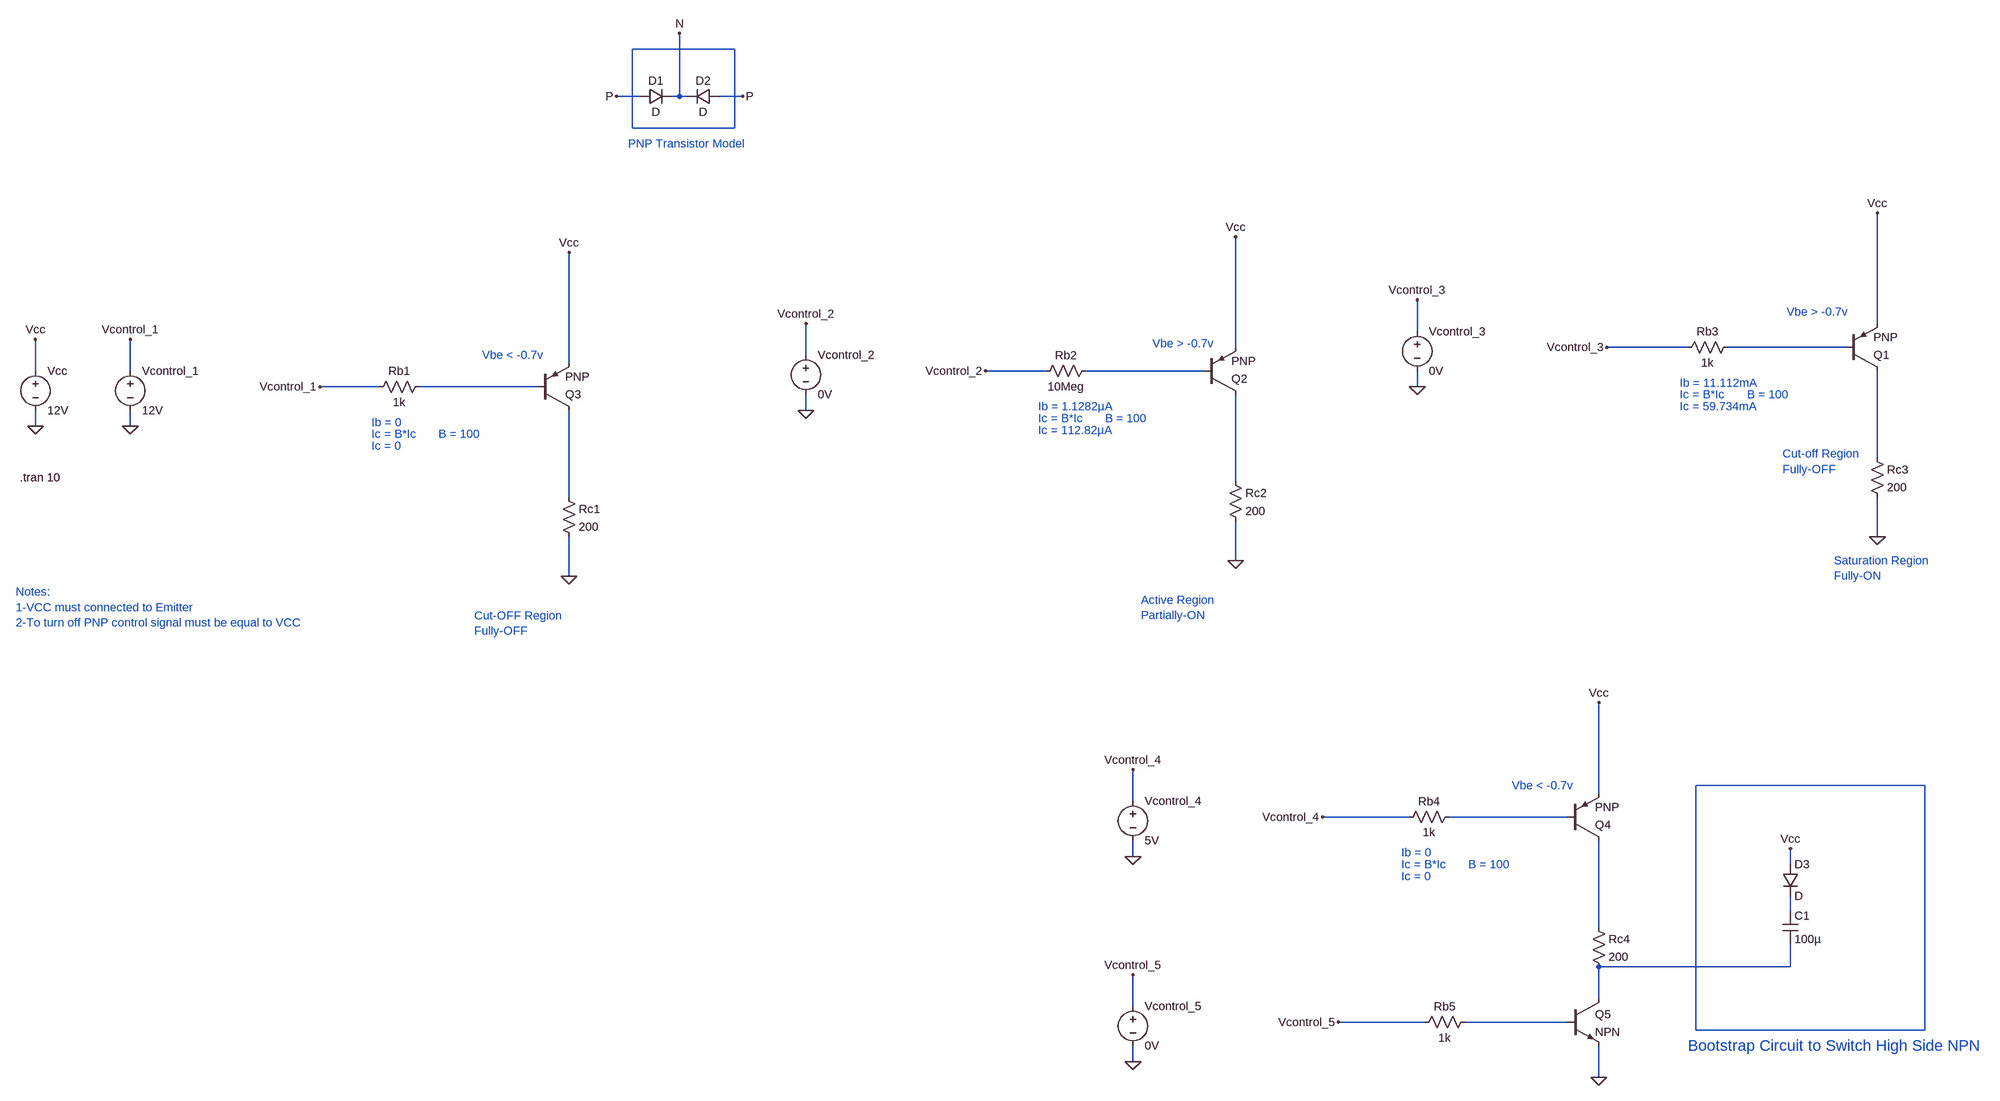
[diagram p0: schematic PNP Transistor.asc]
PNP Transistor.asc, the LTspice schematic file:
Version 4.1
SHEET 1 3440 2628
WIRE 768 -672 560 -672
WIRE 576 -576 528 -576
WIRE 656 -576 656 -704
WIRE 656 -576 640 -576
WIRE 672 -576 656 -576
WIRE 784 -576 736 -576
WIRE 560 -512 560 -672
WIRE 768 -512 768 -672
WIRE 768 -512 560 -512
WIRE 3168 48 3168 -176
WIRE 2224 64 2224 0
WIRE 1856 96 1856 -128
WIRE 2784 96 2608 96
WIRE 3104 96 2864 96
WIRE 912 112 912 48
WIRE 432 128 432 -96
WIRE -704 144 -704 80
WIRE -512 144 -512 80
WIRE 1472 144 1296 144
WIRE 1792 144 1552 144
WIRE 48 176 -128 176
WIRE 368 176 128 176
WIRE 2224 176 2224 144
WIRE 912 224 912 192
WIRE -704 256 -704 224
WIRE -512 256 -512 224
WIRE 3168 320 3168 144
WIRE 1856 368 1856 192
WIRE 432 400 432 224
WIRE 3168 480 3168 400
WIRE 1856 528 1856 448
WIRE 432 560 432 480
WIRE 3264 1904 2800 1904
WIRE 2592 1920 2592 1696
WIRE 1648 1936 1648 1872
WIRE 2208 1968 2032 1968
WIRE 2528 1968 2288 1968
WIRE 1648 2048 1648 2016
WIRE 2992 2064 2992 2032
WIRE 2992 2160 2992 2128
WIRE 2592 2192 2592 2016
WIRE 2992 2272 2992 2224
WIRE 2992 2272 2592 2272
WIRE 2592 2336 2592 2272
WIRE 1648 2352 1648 2288
WIRE 2240 2384 2064 2384
WIRE 2528 2384 2320 2384
WIRE 2800 2400 2800 1904
WIRE 3264 2400 3264 1904
WIRE 3264 2400 2800 2400
WIRE 1648 2464 1648 2432
WIRE 2592 2496 2592 2432
FLAG 3168 480 0
FLAG 2608 96 Vcontrol_3
FLAG 3168 -176 Vcc
FLAG -704 256 0
FLAG -704 80 Vcc
FLAG 2224 176 0
FLAG 2224 0 Vcontrol_3
FLAG 528 -576 P
FLAG 784 -576 P
FLAG 656 -704 N
FLAG 1856 528 0
FLAG 1296 144 Vcontrol_2
FLAG 1856 -128 Vcc
FLAG 912 224 0
FLAG 912 48 Vcontrol_2
FLAG 432 560 0
FLAG -128 176 Vcontrol_1
FLAG 432 -96 Vcc
FLAG -512 256 0
FLAG -512 80 Vcontrol_1
FLAG 2032 1968 Vcontrol_4
FLAG 2592 1696 Vcc
FLAG 1648 2048 0
FLAG 1648 1872 Vcontrol_4
FLAG 2592 2496 0
FLAG 2064 2384 Vcontrol_5
FLAG 2992 2032 Vcc
FLAG 1648 2464 0
FLAG 1648 2288 Vcontrol_5
DATAFLAG 2704 96 ""
DATAFLAG 3168 -80 ""
DATAFLAG 3168 224 ""
DATAFLAG 2960 96 ""
DATAFLAG 1392 144 ""
DATAFLAG 1856 -32 ""
DATAFLAG 1856 272 ""
DATAFLAG 1648 144 ""
DATAFLAG -32 176 ""
DATAFLAG 432 0 ""
DATAFLAG 432 304 ""
DATAFLAG 224 176 ""
DATAFLAG 2128 1968 ""
DATAFLAG 2592 1792 ""
DATAFLAG 2592 2096 ""
DATAFLAG 2384 1968 ""
DATAFLAG 2160 2384 ""
DATAFLAG 2416 2384 ""
SYMBOL res 2880 80 R90
WINDOW 0 0 56 VBottom 2
WINDOW 3 32 56 VTop 2
SYMATTR InstName Rb3
SYMATTR Value 1k
SYMBOL voltage -704 128 R0
SYMATTR InstName Vcc
SYMATTR Value 12V
SYMBOL voltage 2224 48 R0
WINDOW 123 0 0 Left 0
WINDOW 39 0 0 Left 0
SYMATTR InstName Vcontrol_3
SYMATTR Value 0V
SYMBOL diode 576 -560 R270
WINDOW 0 32 32 VTop 2
WINDOW 3 0 32 VBottom 2
SYMATTR InstName D1
SYMBOL diode 736 -592 R90
WINDOW 0 0 32 VBottom 2
WINDOW 3 32 32 VTop 2
SYMATTR InstName D2
SYMBOL pnp 3104 144 M180
SYMATTR InstName Q1
SYMBOL res 3152 304 R0
SYMATTR InstName Rc3
SYMATTR Value 200
SYMBOL res 1568 128 R90
WINDOW 0 0 56 VBottom 2
WINDOW 3 32 56 VTop 2
SYMATTR InstName Rb2
SYMATTR Value 10Meg
SYMBOL voltage 912 96 R0
WINDOW 123 0 0 Left 0
WINDOW 39 0 0 Left 0
SYMATTR InstName Vcontrol_2
SYMATTR Value 0V
SYMBOL pnp 1792 192 M180
SYMATTR InstName Q2
SYMBOL res 1840 352 R0
SYMATTR InstName Rc2
SYMATTR Value 200
SYMBOL res 144 160 R90
WINDOW 0 0 56 VBottom 2
WINDOW 3 32 56 VTop 2
SYMATTR InstName Rb1
SYMATTR Value 1k
SYMBOL voltage -512 128 R0
WINDOW 123 0 0 Left 0
WINDOW 39 0 0 Left 0
SYMATTR InstName Vcontrol_1
SYMATTR Value 12V
SYMBOL pnp 368 224 M180
SYMATTR InstName Q3
SYMBOL res 416 384 R0
SYMATTR InstName Rc1
SYMATTR Value 200
SYMBOL res 2304 1952 R90
WINDOW 0 0 56 VBottom 2
WINDOW 3 32 56 VTop 2
SYMATTR InstName Rb4
SYMATTR Value 1k
SYMBOL voltage 1648 1920 R0
WINDOW 123 0 0 Left 0
WINDOW 39 0 0 Left 0
SYMATTR InstName Vcontrol_4
SYMATTR Value 5V
SYMBOL pnp 2528 2016 M180
SYMATTR InstName Q4
SYMBOL res 2576 2176 R0
SYMATTR InstName Rc4
SYMATTR Value 200
SYMBOL npn 2528 2336 R0
SYMATTR InstName Q5
SYMBOL res 2336 2368 R90
WINDOW 0 0 56 VBottom 2
WINDOW 3 32 56 VTop 2
SYMATTR InstName Rb5
SYMATTR Value 1k
SYMBOL diode 2976 2064 R0
SYMATTR InstName D3
SYMBOL cap 2976 2160 R0
WINDOW 3 24 56 Left 2
SYMATTR InstName C1
SYMATTR Value 100µ
SYMATTR Description Capacitor
SYMATTR Type cap
SYMATTR SpiceLine V=25 Irms=250m Rser=0.6 Lser=0 mfg="Nichicon" pn="UPG1E101MPH" type="Al electrolytic"
SYMBOL voltage 1648 2336 R0
WINDOW 123 0 0 Left 0
WINDOW 39 0 0 Left 0
SYMATTR InstName Vcontrol_5
SYMATTR Value 0V
TEXT -736 360 Left 2 !.tran 10
TEXT 2976 312 Left 2 ;Cut-off Region\nFully-OFF
TEXT 2984 24 Left 2 ;Vbe > -0.7v
TEXT 3080 528 Left 2 ;Saturation Region\nFully-ON
TEXT 2768 168 Left 2 ;Ib = 11.112mA
TEXT 2768 192 Left 2 ;Ic = B*Ic
TEXT 2768 216 Left 2 ;Ic = 59.734mA
TEXT 2904 192 Left 2 ;B = 100
TEXT 552 -480 Left 2 ;PNP Transistor Model
TEXT 1664 608 Left 2 ;Active Region\nPartially-ON
TEXT 1688 88 Left 2 ;Vbe > -0.7v
TEXT 1456 216 Left 2 ;Ib = 1.1282µA
TEXT 1456 240 Left 2 ;Ic = B*Ic
TEXT 1456 264 Left 2 ;Ic = 112.82µA
TEXT 1592 240 Left 2 ;B = 100
TEXT 240 640 Left 2 ;Cut-OFF Region\nFully-OFF
TEXT 256 112 Left 2 ;Vbe < -0.7v
TEXT 32 248 Left 2 ;Ib = 0
TEXT 32 272 Left 2 ;Ic = B*Ic
TEXT 32 296 Left 2 ;Ic = 0
TEXT 168 272 Left 2 ;B = 100
TEXT -744 592 Left 2 ;Notes: \n1-VCC must connected to Emitter\n2-To turn off PNP control signal must be equal to VCC
TEXT 2416 1904 Left 2 ;Vbe < -0.7v
TEXT 2192 2040 Left 2 ;Ib = 0
TEXT 2192 2064 Left 2 ;Ic = B*Ic
TEXT 2192 2088 Left 2 ;Ic = 0
TEXT 2328 2064 Left 2 ;B = 100
TEXT 2784 2432 Left 3 ;Bootstrap Circuit to Switch High Side NPN

The netlist it stands for:
* PNP Transistor.asc
Rb3 N002 Vcontrol_3 1k
Vcc Vcc 0 12V
Vcontrol_3 Vcontrol_3 0 0V
D1 P N D
D2 P N D
Q1 N005 N002 Vcc 0 PNP
Rc3 N005 0 200
Rb2 N003 Vcontrol_2 10Meg
Vcontrol_2 Vcontrol_2 0 0V
Q2 N006 N003 Vcc 0 PNP
Rc2 N006 0 200
Rb1 N004 Vcontrol_1 1k
Vcontrol_1 Vcontrol_1 0 12V
Q3 N007 N004 Vcc 0 PNP
Rc1 N007 0 200
Rb4 N009 Vcontrol_4 1k
Vcontrol_4 Vcontrol_4 0 5V
Q4 N011 N009 Vcc 0 PNP
Rc4 N011 N012 200
Q5 N012 N013 0 0 NPN
Rb5 N013 Vcontrol_5 1k
D3 Vcc N010 D
C1 N010 N012 100µ V=25 Irms=250m Rser=0.6 Lser=0 mfg="Nichicon" pn="UPG1E101MPH" type="Al electrolytic"
Vcontrol_5 Vcontrol_5 0 0V
.model D D
.lib standard.dio
.model NPN NPN
.model PNP PNP
.lib standard.bjt
.tran 10
* Cut-off Region
* Fully-OFF
* Vbe > -0.7v
* Saturation Region
* Fully-ON
* Ib = 11.112mA
* Ic = B*Ic
* Ic = 59.734mA
* B = 100
* PNP Transistor Model
* Active Region
* Partially-ON
* Vbe > -0.7v
* Ib = 1.1282µA
* Ic = B*Ic
* Ic = 112.82µA
* B = 100
* Cut-OFF Region
* Fully-OFF
* Vbe < -0.7v
* Ib = 0
* Ic = B*Ic
* Ic = 0
* B = 100
* Notes:
* 1-VCC must connected to Emitter
* 2-To turn off PNP control signal must be equal to VCC
* Vbe < -0.7v
* Ib = 0
* Ic = B*Ic
* Ic = 0
* B = 100
* Bootstrap Circuit to Switch High Side NPN
.backanno
.end